# EAGLE design eeZeeLED (EAGLE 6.4)
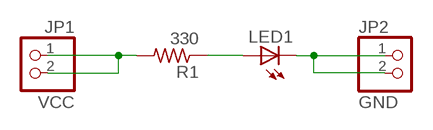
[diagram p0: schematic, sheet 1]

## Parts
JP1  VCC  PINHD-1X02_2.54-S  [1X02-S]
JP2  GND  PINHD-1X02_2.54-S  [1X02-S]
LED1  LEDCHIPLED_0805  [CHIPLED_0805]
R1  330  R-US_R0603  [R0603]

## Nets
N$1: LED1.A R1.1
N$2: JP2.1 JP2.2 LED1.C
N$3: JP1.1 JP1.2 R1.2

## Library data of the parts
JP1 JP2 = pinhead-2:PINHD-1X02: PIN HEADER
LED1 = bt_opto:LED: LED Various packages
R1 = rcl:R-US_: RESISTOR, American symbol

## Board
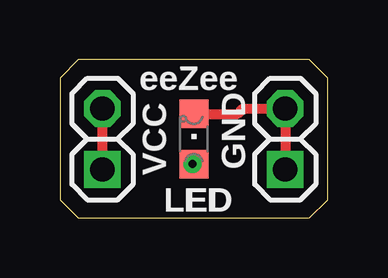
[diagram p1: board, top side]
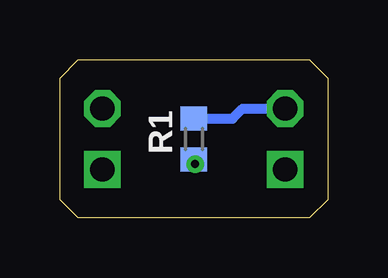
[diagram p2: board, bottom side, seen from below]

Size 11.18 x 6.6 mm. Coordinates in mm from the lower left corner, seen from the top.
Outline: 0,5.84 0,0.76 0.76,0 10.41,0 11.18,0.76 11.18,5.84 10.41,6.6 0.76,6.6 0,5.84
Copper layers (1*16): Top 0.035mm / dielectric 1.5mm / Bottom 0.035mm
Design rules "default": minimum track width 10mil, minimum drill 24mil, track to track 8mil, track to pad 8mil, pad to pad 8mil, via to via 8mil, smd to smd 8mil, copper to edge 40mil, drill to drill 8mil, minimum pad ring 10mil, minimum via ring 8mil, stop-mask expansion 4mil, vias tented up to drill 0mil, thermal gap 10mil

### Footprints (pad centres in the part's own frame; a part is rotated, then mirrored left to right if it is on the bottom)
1X02-S = drill 1.016 square: 1 -1.27,0 | drill 1.016 octagon: 2 1.27,0
CHIPLED_0805 = smd 1.2 x 1.2: A 0,-1.05; C 0,1.05
R0603 = smd 1 x 1.1: 1 -0.85,0; 2 0.85,0

### Placement (x,y rotation side)
JP1  1.78,3.3 90 top
JP2  9.4,3.3 90 top
LED1  5.59,3.3 0 top
R1  5.59,3.3 90 bottom

### Tracks (layer width: path | path; a pad name or v marks a point on that pad's centre or on a via)
N$1  (via drill 0.33)
  Top 0.406: LED1.A v5.53,2.25
  Bottom 0.406: v5.53,2.25 R1.1
N$2
  Top 0.406: JP2.1 JP2.2 7.62,4.57 7.4,4.35 LED1.C
N$3
  Top 0.406: JP1.1 JP1.2
  Bottom 0.406: R1.2 3.98,4.15 3.56,4.57 JP1.2

### Text on the board
tNames: eeZee | LED
tsilk: eeZee | VCC | GND | LED
bsilk: R1